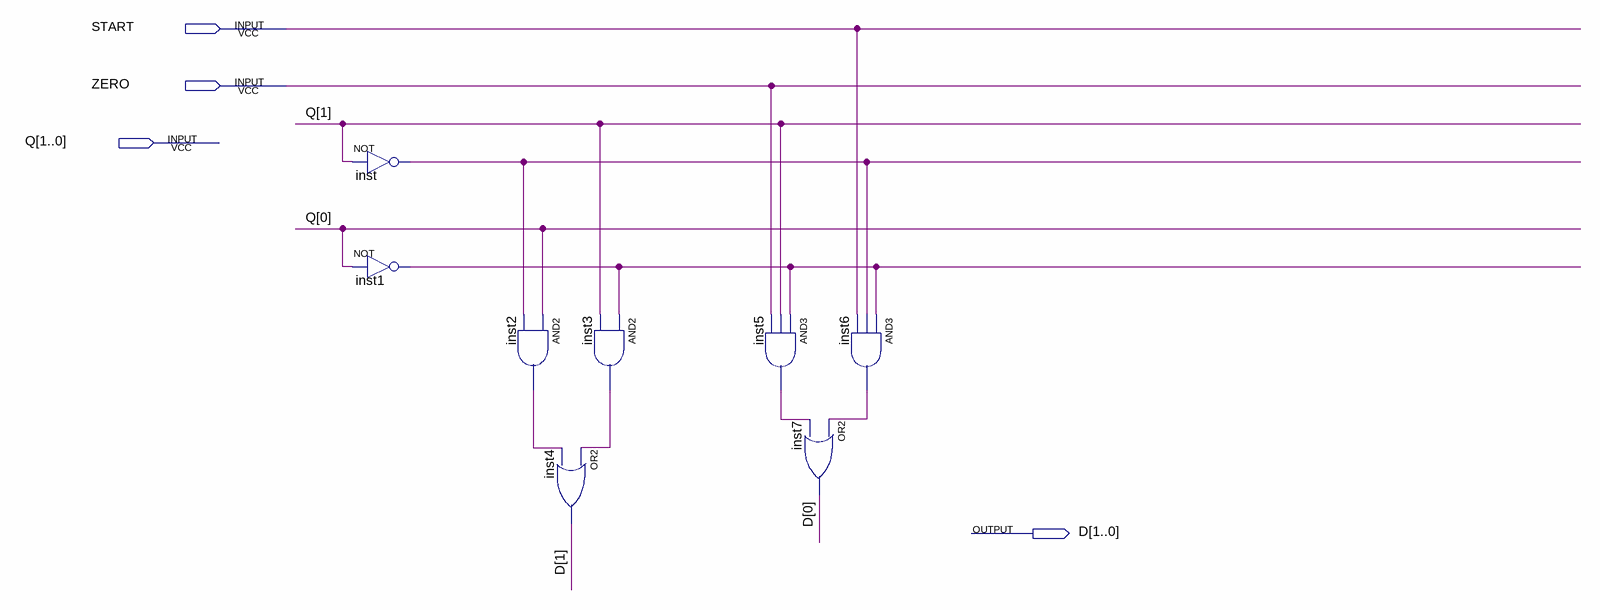
[diagram p0: schematic sheet]
// Quartus schematic NEXT_STAGE.bdf as structural Verilog: 8 symbols, 4 pins
module NEXT_STAGE (
  input  START,
  input  ZERO,
  input  [1:0] Q,
  output [1:0] D
);

  wire inst1_out, inst2_out, inst3_out, inst5_out, inst6_out, inst_out;

  not inst (inst_out, Q[1]);
  not inst1 (inst1_out, Q[0]);
  and inst2 (inst2_out, Q[0], inst_out);
  or inst4 (D[1], inst3_out, inst2_out);
  and inst3 (inst3_out, inst1_out, Q[1]);
  and inst5 (inst5_out, inst1_out, Q[1], ZERO);
  and inst6 (inst6_out, inst1_out, inst_out, START);
  or inst7 (D[0], inst6_out, inst5_out);
endmodule
